# Altium schematic sheet EPS_MCU.SchDoc
size A4; SheetNumber: 2; SheetTotal: 4
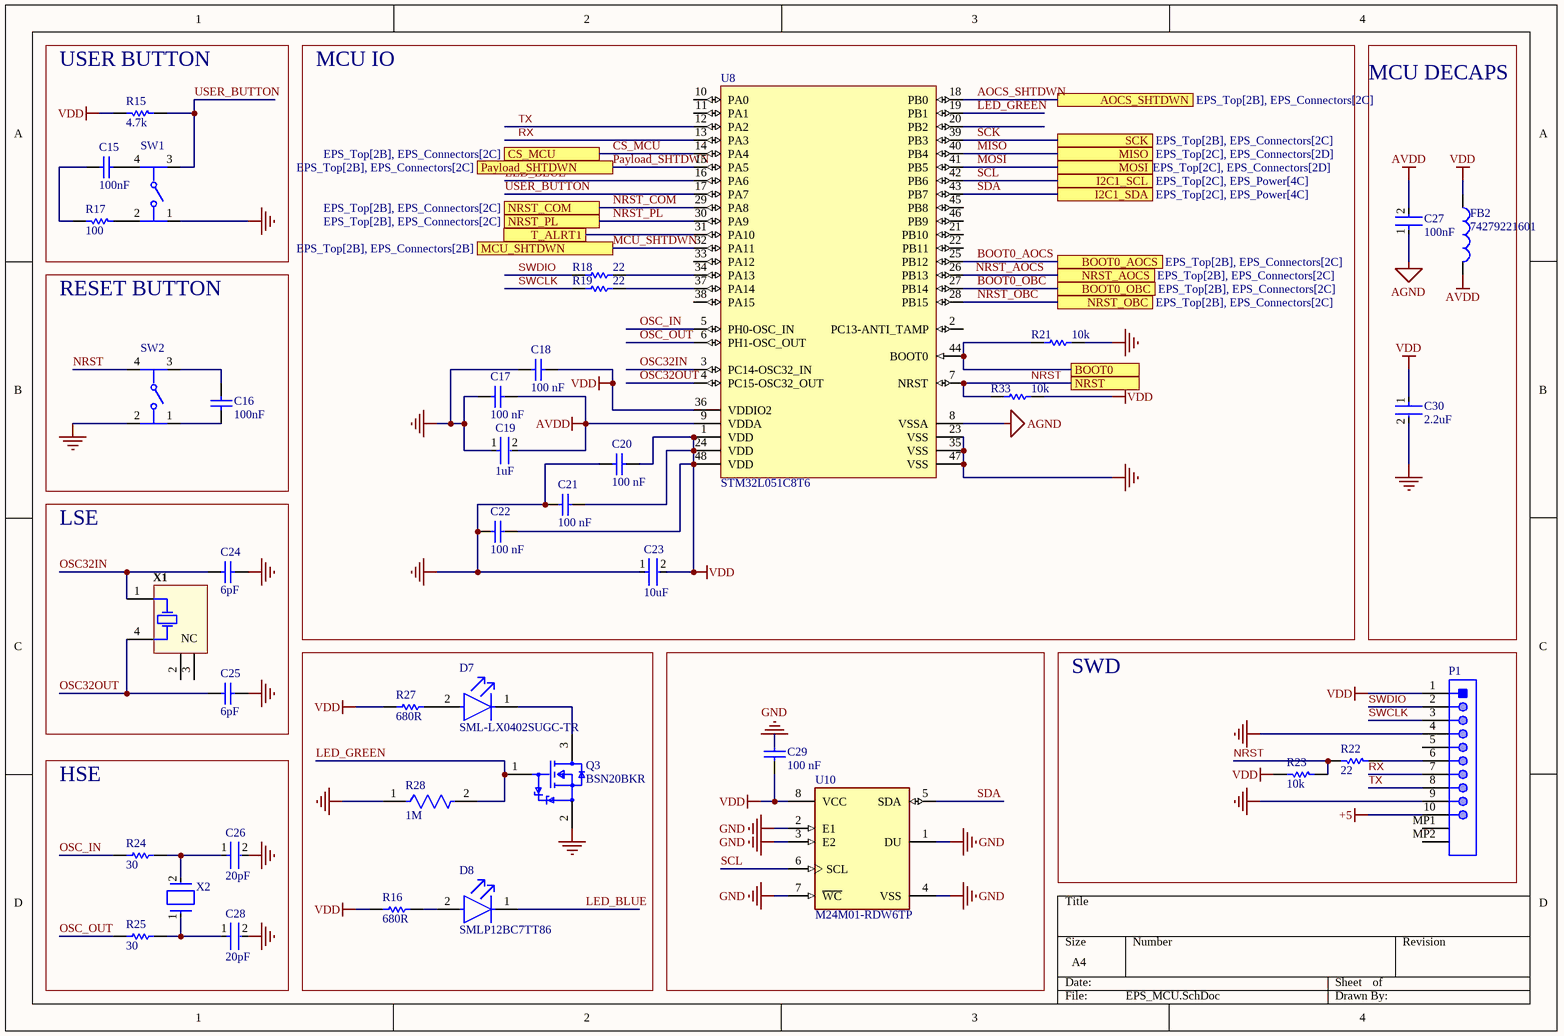
[diagram p0: EPS_MCU.SchDoc]

## Parts
C15  100nF  [CAPC1050X55X23ML05T13]
C16  100nF  [CAPC1050X55X23ML05T13]
C17  100 nF  [CAPC1050X55X23ML05T13]
C18  100 nF  [CAPC1050X55X23ML05T13]
C19  1uF  [FP-CL10-IPC_A]
C20  100 nF  [CAPC1050X55X23ML05T13]
C21  100 nF  [CAPC1050X55X23ML05T13]
C22  100 nF  [CAPC1050X55X23ML05T13]
C23  10uF  [FP-CL21B106KOQNNNG-MFG]
C24  6pF  [CAPC1005X55X25ML05T10]
C25  6pF  [CAPC1005X55X25ML05T10]
C26  20pF  [FP-GCM155-0_05-IPC_C]
C27  100nF  [FP-CC0402-MFG]
C28  20pF  [FP-GCM155-0_05-IPC_C]
C29  100 nF  [CAPC1050X55X23ML05T13]
C30  2.2uF  [FP-CL10-IPC_A]
D7  SML-LX0402SUGC-TR  [FP-SML-LX0402SUGC-TR-MFG]
D8  SMLP12BC7TT86  [FP-SML-P12-MFG]
FB2  74279221601  [WE-MPSB_1206_L3.2W1.6H1.1]
P1  SM10B-SHLS-TF(LF)(SN)  [JST-SM10B-SHLS-TF_V]  (value not drawn)
Q3  BSN20BKR  [FP-SOT23-IPC_C]
R15  4.7k  [RESC1005X40X25LL05T05]
R16  680R  [RESC1005X40X25ML05T05]
R17  100  [RESC1608X55X30LL15T15]
R18  22  [RESC1608X55X25NL10T15]
R19  22  [RESC1608X55X25NL10T15]
R21  10k  [RESC1005X40X25LL05T10]
R22  22  [RESC1608X55X25NL10T15]
R23  10k  [RESC1005X40X25LL05T10]
R24  30  [RESC1609X50X30NL10T20]
R25  30  [RESC1609X50X30NL10T20]
R27  680R  [RESC1005X40X25ML05T05]
R28  1M  [FP-MCR01-IPC_B]
R33  10k  [RESC1005X40X25LL05T10]
SW1  PTS810SJM250SMTRLFS  [FP-PTS810SJM250SMTRLFS-MFG]  (value not drawn)
SW2  PTS810SJM250SMTRLFS  [FP-PTS810SJM250SMTRLFS-MFG]  (value not drawn)
U8  STM32L051C8T6  [STM-LQFP48_L]
U10  M24M01-RDW6TP  [FP-TSSOP8-TSSOP8AM-IPC_A]
X1  ABS25-32.768KHZ-6-T  [ABRA-ABS25-4_V]  (value not drawn)
X2  ABM3-8.000MHZ-D2Y-T  [FP-ABM3-MFG]  (value not drawn)

## Blocks framed on the sheet
USER BUTTON: C15 R15 R17 SW1
MCU IO: C17-C23 R18 R19 R21 R33 U8
MCU DECAPS: C27 C30 FB2
RESET BUTTON: C16 SW2
LSE: C24 C25 X1
SWD: P1 R22 R23
HSE: C26 C28 R24 R25 X2

## Ports
AOCS_SHTDWN (see EPS_Top[2B], EPS_Connectors[2C]), BOOT0 (see EPS_Top[2B], EPS_Connectors[2D]), BOOT0_AOCS (see EPS_Top[2B], EPS_Connectors[2C]), BOOT0_OBC (see EPS_Top[2B], EPS_Connectors[2C]), CS_MCU (see EPS_Top[2B], EPS_Connectors[2C]), I2C1_SCL (see EPS_Top[2C], EPS_Power[4C]), I2C1_SDA (see EPS_Top[2C], EPS_Power[4C]), MCU_SHTDWN (see EPS_Top[2B], EPS_Connectors[2B]), MISO (see EPS_Top[2C], EPS_Connectors[2D]), MOSI (see EPS_Top[2C], EPS_Connectors[2D]), NRST (see EPS_Top[2B], EPS_Connectors[2D]), NRST_AOCS (see EPS_Top[2B], EPS_Connectors[2C]), NRST_COM (see EPS_Top[2B], EPS_Connectors[2C]), NRST_OBC (see EPS_Top[2B], EPS_Connectors[2C]), NRST_PL (see EPS_Top[2B], EPS_Connectors[2C]), Payload_SHTDWN (see EPS_Top[2B], EPS_Connectors[2C]), SCK (see EPS_Top[2B], EPS_Connectors[2C]), T_ALRT1 (see EPS_Top[2C], EPS_Power[4D])

## Nets
+5: P1.10
AGND: C27.1 U8.8(VSSA)
AVDD: C17.2 C19.2 C27.2 FB2.2 U8.9(VDDA)
GND: C17.1 C18.1 C19.1 C20.1 C21.1 C22.1 C23.1 C24.2 C25.2 C26.2 C28.2 C29.2 C30.2 P1.4 P1.9 Q3.2(S) R21.1 R28.1 SW1.1 SW2.2 U8.23(VSS) U8.35(VSS) U8.47(VSS) U10.1(DU) U10.2(E1) U10.3(E2) U10.4(VSS) U10.7(~{WC})
VDD: C18.2 C20.2 C21.2 C22.2 C23.2 C29.1 C30.1 FB2.1 P1.1 R15.2 R16.1 R23.1 R27.1 R33.1 U8.1(VDD) U8.24(VDD) U8.36(VDDIO2) U8.48(VDD) U10.8(VCC)
AOCS_SHTDWN: U8.18(PB0) ; port AOCS_SHTDWN
BOOT0: R21.2 U8.44(BOOT0) ; port BOOT0
BOOT0_AOCS: U8.25(PB12) ; port BOOT0_AOCS
BOOT0_OBC: U8.27(PB14) ; port BOOT0_OBC
CS_MCU: U8.14(PA4) ; port CS_MCU
LED_BLUE: D8.1(C) U8.16(PA6)
LED_GREEN: Q3.1(G) R28.2 U8.19(PB1)
MCU_SHTDWN: U8.32(PA11) ; port MCU_SHTDWN
MISO: U8.40(PB4) ; port MISO
MOSI: U8.41(PB5) ; port MOSI
NRST: R22.2 R23.2 R33.2 SW2.4 U8.7(NRST) ; port NRST
NRST_AOCS: U8.26(PB13) ; port NRST_AOCS
NRST_COM: U8.29(PA8) ; port NRST_COM
NRST_OBC: U8.28(PB15) ; port NRST_OBC
NRST_PL: U8.30(PA9) ; port NRST_PL
OSC32IN: C24.1 U8.3(PC14-OSC32_IN) X1.1(X1)
OSC32OUT: C25.1 U8.4(PC15-OSC32_OUT) X1.4(X2)
OSC_IN: R24.1 U8.5(PH0-OSC_IN)
OSC_OUT: R25.1 U8.6(PH1-OSC_OUT)
Payload_SHTDWN: U8.15(PA5) ; port Payload_SHTDWN
RX: P1.7 U8.13(PA3)
SCK: U8.39(PB3) ; port SCK
SCL: U8.42(PB6) U10.6(SCL) ; port I2C1_SCL
SDA: U8.43(PB7) U10.5(SDA) ; port I2C1_SDA
SWCLK: P1.3 R19.1
SWDIO: P1.2 R18.1
T_ALRT1: U8.31(PA10) ; port T_ALRT1
TX: P1.8 U8.12(PA2)
USER_BUTTON: R15.1 SW1.3 U8.17(PA7)
NetC15_1: C15.1 SW1.4
NetC15_2: C15.2 R17.2
NetC16_1: C16.1 SW2.1
NetC16_2: C16.2 SW2.3
NetC26_1: C26.1 R24.2 X2.2
NetC28_1: C28.1 R25.2 X2.1
NetD7_1: D7.1(C) Q3.3(D)
NetD7_2: D7.2(A) R27.2
NetD8_2: D8.2(A) R16.2
NetP1_6: P1.6 R22.1
NetR17_1: R17.1 SW1.2
NetR18_2: R18.2 U8.34(PA13)
NetR19_2: R19.2 U8.37(PA14)

Not connected (* = marked no-connect by the designer): P1 5 MP1 MP2; U8 2(PC13-ANTI_TAMP) 10(PA0) 11(PA1) 20(PB2) 21(PB10) 22(PB11) 33(PA12) 38(PA15) 45(PB8) 46(PB9); X1 2(NC) 3(NC)

## Library data of the parts
C15-C18 C20-C22 C29 = CMP-2000-05439-1: Chip Capacitor, 100 nF, +/- 10%, 16 V, -55 to 125 degC, 0402 (1005 Metric), RoHS, Tape and Reel; Manufacturer: Samsung Electro-Mechanics; Capacitance: 100000pF; Dielectric: X7R; Rated Voltage: 16V; Case Size/Dimension: 0402; Tolerance (%): ±10%; Manufacturer URL: http://www.samsungsem.com/global/index.jsp; Datasheet URL: https://datasheet.ciiva.com/29198/458718-da-01-en-vs-kondensator-0402-29198423.pdf; Datasheet Version: Nov-10
C19 = CMP-13271-001457-1: Cap Ceramic 1uF 16V X5R ±10% Pad SMD 0603 +85°C T/R; Dielectric: X5R; Height: 0.8mm; Capacitance: 1uF; Mount: Surface Mount; Thickness: 0.035inch; Width: 0.031inch; Min Operating Temperature: -55°C; Contact Plating: Tin; Case Code (Imperial): 0603; Depth: 0.8mm; Length: 1.6mm; Max Operating Temperature: 85°C; Packaging: Tape and Reel; Tolerance: 10%; Radiation Hardening: No; Case/Package: 0603; Package Quantity: 1; Voltage Rating: 16V; Case Code (Metric): 1608; Voltage: 16V; Material: Ceramic; Lead Free: Lead Free; Voltage Rating (DC): 16V
C23 = CMP-13271-000015-1: CAP CER 10UF 16V X7R 0805; Manufacturer Part Number: CL21B106KOQNNNG; Manufacturer: Samsung Electro-Mechanics; Temperature Coefficient: 15%; Tolerance: 10%; Material: Ceramic; ComponentLink2URL: http://product.samsungsem.com/mlcc/CL21B106KOQNNN.do; Package: 0; Voltage Rating: 16V; Value: 10uF; Height: 1.4mm; Temperature Characteristic: X7R; Category: Cap; Lead Free: Yes; RoHS: TRUE; ComponentLink2Description: Datasheet; Octopart: https://octopart.com/cl21b106koqnnng-samsung-19995691; Device Class L1: Passive Components; Temperature Range Low: -55°C; Device Class L3: Ceramic Capacitors; Ipc Land Pattern Name: CAPC200125X125; Digikey Description: CAP CER 10UF 16V X7R 0805; Automotive: No; Capacitance: 10uF; Temperature Range High: +125°C; Device Class L2: Capacitors; Temperature: -55°C to +125°C
C24 C25 = CMP-2008-04413-1: Part Number: GRM1555C1H6R0DA01D; Manufacturer: Murata
C26 C28 = CMP-06035-011115-1: Ceramic Capacitor for Automotive 20pF ±2% 50VDC C0G 0402 Paper T/R
C27 = CMP-03422-000048-1: CAP CER 0.1UF 16V X7R 0402; Manufacturer: YAGEO; Manufacturer Part Number: CC0402KRX7R7BB104; Material: Ceramic; Automotive Grade: NA; Temperature Coefficient: 30ppm/°C; Tolerance: 0.1; Device Class L1: Passive Components; Temperature Range Low: -55°C; Device Class L3: Ceramic Capacitors; Temperature Characteristic: X7R; Ipc Land Pattern Name: CAPC10050X50; Capacitance: 100 nF; Temperature Range High: +125°C; Voltage Rating: 16 V; Temperature: -55°C to +125°C; RoHS: TRUE; Automotive: No; Height: 0.55mm; Device Class L2: Capacitors; Digikey Description: CAP CER 0.1UF 16V X7R 0402; Package: CC0402; Footprint Url: http://www.yageo.com/exep/pages/download/literatures/UPY-C_GEN_24.pdf; ComponentLink2Description: Datasheet; Category: Cap; Lead Free: Yes; Value: 100 nF; Octopart: https://octopart.com/cc0402krx7r7bb104-yageo-42244624; ComponentLink2URL: http://www.yageo.com/documents/recent/UPY-GP_NP0_16V-to-50V_16.pdf; Mouser Description: 0402 0.1 uF 16 V ±10 % Tolerance X7R SMT Multilayer Ceramic Capacitor
C30 = CMP-13271-000835-1: Cap Ceramic 2.2uF 16V X5R ±10% Pad SMD 0603 +85°C T/R; Case Code (Metric): 1608; Height: 0.8mm; Case/Package: 0603; Depth: 0.8mm; Capacitance: 2.2uF; Voltage Rating: 16V; Case Code (Imperial): 0603; Length: 1.6mm; Packaging: Tape and Reel; Material: Ceramic; Lead Free: Lead Free; Max Operating Temperature: 85°C; Contact Plating: Tin; Thickness: 0.035inch; Radiation Hardening: No; Tolerance: 10%; Min Operating Temperature: -55°C; Voltage: 16V; Dielectric: X5R; Mount: Surface Mount; Package Quantity: 4000; Width: 0.031inch; Voltage Rating (DC): 16V
D7 = CMP-57192-000001-1: LED GREEN CLEAR SMD; Forward Voltage: 2.2V; Test Current: 20mA; Luminous Intensity: 45mcd; Lens Style: Diffused; Number of LEDs: 1; Approvals: UL; Lens Color: Colorless; Dominant Wavelength: 574nm; Viewing Angle: 120°; Lead Free: Lead Free; Case/Package: 0402; Number of Pins: 2; Width: 0.5mm; Min Operating Temperature: -40°C; Case Code (Imperial): 0402; Packaging: Tape and Reel; Color: Green; Max Operating Temperature: 85°C; Case Code (Metric): 1005; Mount: Surface Mount; Length: 1mm; Wavelength: 574nm; Height: 0.5mm; Illumination Color: Green; Lens Transparency: Clear; Package Quantity: 1; Forward Current: 20mA
D8 = CMP-08952-000025-1: LED BLUE CLEAR 1006 SMD; Manufacturer: Rohm; Led Orientation: Top View; Reverse Voltage: 5V; Wavelength: 470nm; Luminous Intensity: 17mcd; Power Dissipation: 66mW; Forward Voltage: 2.9V; Forward Current: 5mA; ComponentLink2URL: https://media.digikey.com/pdf/Data%20Sheets/Rohm%20PDFs/SML-P1_Series_RevB.pdf; ComponentLink2Description: Datasheet; Colour: Blue; RoHS: TRUE; Package: SML-P12; Device Class L1: Optoelectronics; Manufacturer Part Number: SMLP12BC7TT86; Automotive: No; Temperature Range Low: -40°C; Temperature: -40°C to +85°C; Height: 0.25mm; Octopart: https://octopart.com/smlp12bc7tt86-rohm-9290887; Digikey Description: LED BLUE CLEAR 1006 SMD; Lead Free: Yes; Device Class L2: LEDs; Category: Diode; Device Class L3: unset; Mouser Description: ROHM SMLP12BC7TT86, SML-P12 PICOLED Series Blue LED, 1006(0402), Rectangle Lens; Temperature Range High: +85°C
FB2 = CMP-03913-52738347-1: 74279221601 Ferrite Beads Multi-Layer High Current 600Ohm 25% 100MHz 2.5A 0.05Ohm DCR 1206 Automotive T/R; Resistance: 600Ω; DC Resistance (DCR): 38mΩ; Number of Lines: 1; Packaging: Digi-Reel®; Max Operating Temperature: 125°C; Case/Package: 1206; Height: 1.1mm; Tolerance: 25%; Weight: 10.007382mg; NexarPartId: 52738347; Current Rating: 2.5A; Case Code (Metric): 3216; Case Code (Imperial): 1206; Termination: SMD/SMT; Test Frequency: 100MHz; Length: 3.2mm; Width: 1.6mm; Max DC Current: 2.5A; Min Operating Temperature: -55°C; Max Current Rating: 2.5A; Impedance: 600Ω; REACH SVHC: Unknown; Mount: Surface Mount; RoHS: Compliant
P1 = CMP-2000-07083-1: Male Header, Pitch 1 mm, 1 x 10 Position, Height 1.8 mm, -25 to 85 degC; Manufacturer: JST; Datasheet URL: http://www.jst-mfg.com/product/pdf/eng/eSHL.pdf; Mounting Technology: SurfaceMount; Package Reference: SM10B-SHLS-TF; Manufacturer URL: http://www.jst.com/home2.html; Package Description: Male Header, Pitch 1 mm, 1 x 10 Position, Height 1.8 mm; Datasheet Version: 04/2015
Q3 = CMP-14409-000038-1: MOSFET N-CH 60V 265MA TO236AB
R15 = CMP-2002-01154-4: Chip Resistor, 4.7 KOhm, +/- 1%, 0.1 W, -55 to 155 degC, 0402 (1005 Metric), RoHS, Tape and Reel; PartNumber: ERJ-2RKF4701X; Voltage Rating: 50 V; Case\/Package: 0402; Power Rating: 100 mW; Height: 0.35 mm; Mounting Technology: Surface Mount; REACH SVHC: Yes; Resistance: 4.7 KOhm; Max Operating Temperature: 155 degC; ComponentLink1Description: Manufacturer URL; ComponentLink2Description: Datasheet; Pins: 2; PackageReference: 0402; Tolerance: 1%; Case Code (Imperial): 0402; Length: 1 mm; PackageDescription: 2-Pin Surface Mount Device, Body 1 x 0.5 mm; RoHSCompliant: true; Package Quantity: 1; Radiation Hardening: No; DatasheetVersion: 04/2015; Width: 0.5 mm; Case Code (Metric): 1005; Mount: Surface Mount; ComponentLink1URL: http://www.panasonic.com/; Min Operating Temperature: -55 degC; Packaging: Cut Tape; ComponentLink2URL: http://industrial.panasonic.com/cdbs/www-data/pdf/RDA0000/AOA0000C86.pdf
R16 R27 = CMP-2002-00166-1: Manufacturer: Vishay Dale; Part Number: CRCW0402680RFKED
R17 = CMP-2000-00179-1: Manufacturer: Panasonic; Part Number: ERJ-3EKF1000V
R18 R19 R22 = CMP-1659-00033-1: Chip Resistor, 22 Ohm, +/- 1%, 0.1 W, -55 to 155 degC, 0603 (1608 Metric), RoHS, Tape and Reel; Max Ouput Current: 8 A; Case\Package: SIP; Max Input Voltage: 1.4 V; ComponentLink2URL: http://www.yageo.com/documents/recent/PYu-RC_Group_51_RoHS_L_04.pdf; RoHSCompliant: true; Max Operating Temperature: 100 degC; PackageDescription: 2-Pin Surface Mount Device, Body 1.6 x 0.8 mm; ComponentLink1Description: Manufacturer URL; ComponentLink1URL: http://www.yageo.com/; Length: 18.5 mm; REACH SVHC: Unknown; Pins: 4; DatasheetVersion: Rev. 4, 02/2016; PackageReference: 0603; Output Current: 8 A; Min Operating Temperature: -25 degC; Height: 19.6 mm; Mount: Through Hole; Radiation Hardening: No; ComponentLink2Description: Datasheet; Package Quantity: 200; Packaging: Rail/Tube
R21 R23 R33 = CMP-2002-07353-1: Part Number: RC0402FR-0710KL; Manufacturer: Yageo / Phycomp
R24 R25 = CMP-2000-03228-1: Part Number: CRCW060330R0FKEA; Manufacturer: Vishay Dale
R28 = CMP-08839-019445-1: Thick Film Chip Resistor, 0402, 1MΩ, 1%, 100ppm/°C, 0.063W, 50V; Max Power Dissipation: 63mW; Resistance: 1MR; Lead Free: Lead Free; Case Code (Imperial): 0402; Max Operating Temperature: 155°C; Package Quantity: 1; Length: 0.039inch; Temperature Coefficient: 100ppm/°C; Case Code (Metric): 1005; Tolerance: 1%; Case/Package: 0402; RoHS Compliant: Yes; Number of Terminations: 2; Resistor Type: Thick Film; Height: 0.016inch; Packaging: Tape and Reel; Min Operating Temperature: -55°C; Voltage Rating (DC): 50V; Width: 0.02inch; Series: MCR
SW1 SW2 = CMP-10040-000001-2: SWITCH TACTILE SPST-NO 0.05A 16V; Throw Configuration: SPST; Operating Force: 160gf; Actuator Type: Standard; Switch Travel: 0.15mm; Switch Function: Off-Mom; Max Current Rating: 50mA; Mechanical Life: 150000Cycles; Illumination Type: Non-Illuminated; Package Quantity: 2900; Depth: 4.6mm; Mount: Surface Mount; Packaging: Tape and Reel; Length: 3.2mm; RoHS Compliant: Yes; Case/Package: SMD/SMT; Voltage Rating (DC): 16V; Min Operating Temperature: -40°C; Termination: J-Bend; Lead Free: Lead Free; Contact Plating: Silver; Orientation: Straight; Max Operating Temperature: 85°C; Current Rating: 50mA; Color: Black
U8 = CMP-1546-00003-1: Ultra-Low-Power ARM Cortex-M0+ MCU, 64 KB Flash, 1.8 to 3.6 V, -40 to 85 degC, 48-Pin LQFP, RoHS, Tray; RAM: 8 KB; Flash: 64 KB; Data EEPROM: 2 KB; VDD Max: 3.6 V; VDD Min: 1.8 V; PartNumber: STM32L051C8T6; ComponentLink3URL: http://www.st.com/st-web-ui/static/active/en/resource/technical/document/datasheet/DM00058181.pdf; ComponentLink1URL: http://www.st.com/web/en/home.html; Temperature Min: -40 degC; DatasheetVersion: Rev. 4; ComponentLink3Description: Package Specification; Mounting Technology: Surface Mount; ComponentLink1Description: Manufacturer URL; Packing: Tray; Temperature Max: 85 degC; ComponentLink2URL: http://www.st.com/st-web-ui/static/active/en/resource/technical/document/datasheet/DM00108219.pdf; PackageDescription: 48-Pin Frame Chip Scale Package, Body 7 x 7 mm, Pitch 0.5 mm; ComponentLink2Description: Datasheet; RoHS: TRUE
U10 = CMP-12142-000012-1: IC EEPROM 1M I2C 1MHZ 8TSSOP; Manufacturer: STMicroelectronics; Memory Size: 1Mbits; Min Supply Voltage: 1.8V; Access Time: 500ns; Nominal Supply Current: 1-2mA; Max Supply Voltage: 5.5V; Standoff Height: 0.05mm; Package: TSSOP8-TSSOP8AM; Digikey Description: IC EEPROM 1M I2C 1MHZ 8TSSOP; Mouser Description: EEPROM 1-Mbit I2C EEProm 256kB 1.7V to 5.5V; Device Class L3: EEPROM; Temperature Range High: +85°C; Lead Free: Yes; Frequency: 1MHz; Octopart: https://octopart.com/m24m01-rdw6tp-stmicroelectronics-55567287; Temperature: -40°C to +85°C; Memory Type: EEPROM; RoHS: TRUE; Ambient Temperature Range Low: -40°C; Ambient Temperature Range High: +85°C; Height: 1.2mm; Ipc Land Pattern Name: SOP65P300X120-8; Category: IC; ComponentLink2Description: Datasheet; Temperature Range Low: -40°C; Manufacturer Part Number: M24M01-RDW6TP; Device Class L1: Integrated Circuits (ICs); Device Class L2: Memory; Automotive: No; ComponentLink2URL: https://www.st.com/resource/en/datasheet/m24m01-r.pdf; Interface: I2C
X1 = CMP-2000-05036-1: Low Frequency Crystal, 32.768 KHz, 6 pF, +/- 20 ppm, -40 to 85 degC, 4-Pin SMD, RoHS, Tape and Reel; Manufacturer: Abracon; Tolerance: 20PPM; ESR: 50kOhms; Case Width: 3.8mm; Case Height: 2.5mm; Case Length: 8mm; Load Capacitance: 6pF; Operating Temperature Range: -40Cto+85C; Package Reference: ABS25; Factory Pack Quantity: 3000; Package Description: 4-Pin Surface Mount Device, Body 8 x 3.8 mm, Pitch 5.5 mm; Frequency: 32.768kHz; Termination Style: SMD/SMT; Manufacturer URL: http://www.abracon.com/; Type: LowFrequencyCrystal; Dimensions: 3.8mmWx8mmLx2.5mmH; Product Category: Crystals; Series: ABS25; RoHS: Details; Package / Case: 8mmx3.8mm; Datasheet Version: Jun-17; Brand: ABRACON; Datasheet URL: https://datasheet.ciiva.com/854/abs25-854528.pdf; Packaging: Reel; Mounting Style: SMD/SMT
X2 = CMP-2000-05033-2: Crystal 8MHz ±20ppm 18pF SMD-2 5mm x 3.2mm; Series Resistance: 500R; Frequency Stability: 30ppm; ESR (Equivalent Series Resistance): 140R; Load Capacitance: 18pF; Height: 0.051inch; Tolerance: 20ppm; Depth: 3.2mm; Max Operating Temperature: 85°C; Frequency: 8MHz; Termination: SMD/SMT; Lead Free: Lead Free; Number of Pins: 2; Width: 3.2mm; RoHS Compliant: Yes; Resistor Type: Ceramic; Length: 5mm; Mount: Surface Mount; Case/Package: CSMD; Package Quantity: 1000; Radiation Hardening: No; Min Operating Temperature: -40°C; Packaging: Tape and Reel; Frequency Tolerance: 20ppm